# Altium schematic sheet Connector.SchDoc: QUTMS Shutdown V2.1 - Connector
size A4; Organization: QUT Motorsport; Address1: O-120; Address2: O Block; Address3: QUT Gardens Point; Address4: Brisbane, 4000; DocumentNumber: 7; Revision: 3; SheetNumber: 7; SheetTotal: 7
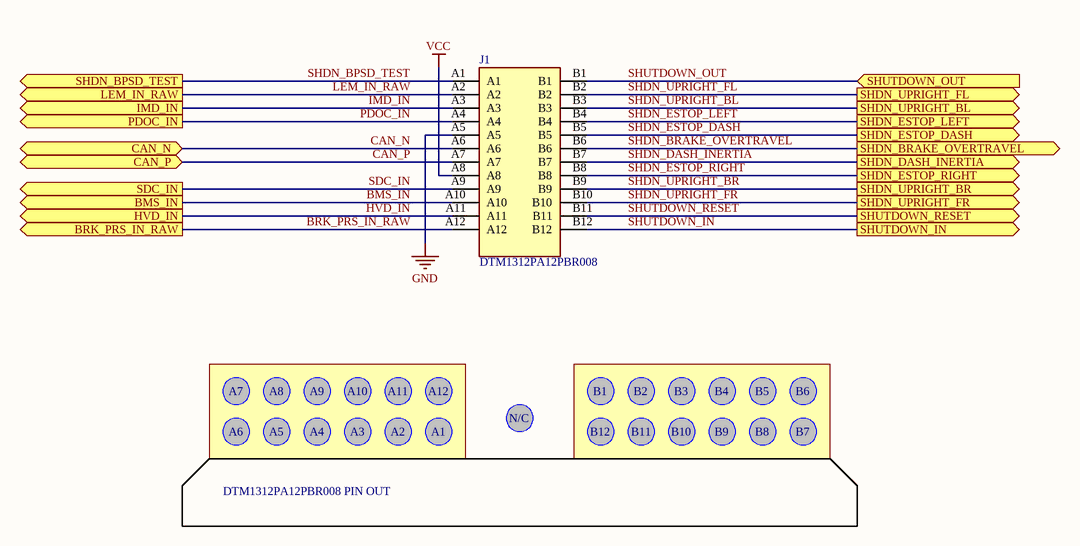
[diagram p0: Connector.SchDoc]

## Parts
J1  DTM1312PA12PBR008  [TE_DTM1312PA12PBR008]

## Ports
BMS_IN (out), BRK_PRS_IN_RAW (out), CAN_N (bidir), CAN_P (bidir), HVD_IN (out), IMD_IN (out), LEM_IN_RAW (out), PDOC_IN (out), SDC_IN (out), SHDN_BPSD_TEST (out), SHDN_BRAKE_OVERTRAVEL (out), SHDN_DASH_INERTIA (out), SHDN_ESTOP_DASH (out), SHDN_ESTOP_LEFT (out), SHDN_ESTOP_RIGHT (out), SHDN_UPRIGHT_BL (out), SHDN_UPRIGHT_BR (out), SHDN_UPRIGHT_FL (out), SHDN_UPRIGHT_FR (out), SHUTDOWN_IN (out), SHUTDOWN_OUT (in), SHUTDOWN_RESET (out)

## Nets
GND: J1.A5
VCC: J1.A8
BMS_IN: J1.A10 ; port BMS_IN
BRK_PRS_IN_RAW: J1.A12 ; port BRK_PRS_IN_RAW
CAN_N: J1.A6 ; port CAN_N
CAN_P: J1.A7 ; port CAN_P
HVD_IN: J1.A11 ; port HVD_IN
IMD_IN: J1.A3 ; port IMD_IN
LEM_IN_RAW: J1.A2 ; port LEM_IN_RAW
PDOC_IN: J1.A4 ; port PDOC_IN
SDC_IN: J1.A9 ; port SDC_IN
SHDN_BPSD_TEST: J1.A1 ; port SHDN_BPSD_TEST
SHDN_BRAKE_OVERTRAVEL: J1.B6 ; port SHDN_BRAKE_OVERTRAVEL
SHDN_DASH_INERTIA: J1.B7 ; port SHDN_DASH_INERTIA
SHDN_ESTOP_DASH: J1.B5 ; port SHDN_ESTOP_DASH
SHDN_ESTOP_LEFT: J1.B4 ; port SHDN_ESTOP_LEFT
SHDN_ESTOP_RIGHT: J1.B8 ; port SHDN_ESTOP_RIGHT
SHDN_UPRIGHT_BL: J1.B3 ; port SHDN_UPRIGHT_BL
SHDN_UPRIGHT_BR: J1.B9 ; port SHDN_UPRIGHT_BR
SHDN_UPRIGHT_FL: J1.B2 ; port SHDN_UPRIGHT_FL
SHDN_UPRIGHT_FR: J1.B10 ; port SHDN_UPRIGHT_FR
SHUTDOWN_IN: J1.B12 ; port SHUTDOWN_IN
SHUTDOWN_OUT: J1.B1 ; port SHUTDOWN_OUT
SHUTDOWN_RESET: J1.B11 ; port SHUTDOWN_RESET

## Notes on the sheet
- A7
- A8
- A9
- A10
- A11
- A12
- N/C
- B1
- B2
- B3
- B4
- B5
- B6
- A6
- A5
- A4
- A3
- A2
- A1
- B12
- B11
- B10
- B9
- B8
- B7
- DTM1312PA12PBR008 PIN OUT
- Title
- Size:
- Number:
- Revision:
- QUT Motorsport, O-120
- O Block, QUT Gardens Point
- Date:
- Time:
- Sheet
- of
- Brisbane, QLD, Australia

## Library data of the parts
J1 = DTM1312PA12PBR008: 24 way sealed A and B key PCB header with .165 inch/4.2 millimeter centerline pitch.; MP: DTM13-12PA-12PB-R008; MF: TE Connectivity; Digi-Key_Part_Number: 1734-1131-ND; Digi-Key_Purchase_URL: https://www.digikey.com/product-detail/en/te-connectivity-deutsch-connectors/DTM13-12PA-12PB-R008/1734-1131-ND/6566695?utm_source=snapeda&utm_medium=aggregator&utm_campaign=symbol; Package: None; Value: *; TE_purchase_URL: https://www.te.com/usa-en/product-DTM1312PA12PBR008.html?te_bu=Cor&te_type=disp&te_campaign=seda_glo_cor-seda-global-disp-prtnr-fy19-seda-model-bom-cta_sma-317_1&elqCampaignId=32493; SnapEDA_Link: https://www.snapeda.com/parts/DTM13-12PA-12PB-R008/TE%20Connectivity%20Deutsch%20Connectors/view-part/490507/?ref=snap